# Altium schematic sheet Amplifier_ADC.SchDoc
size 420 x 297 mm; DocumentNumber: Введите номер платы + Э3; SheetNumber: 5; Format: A3
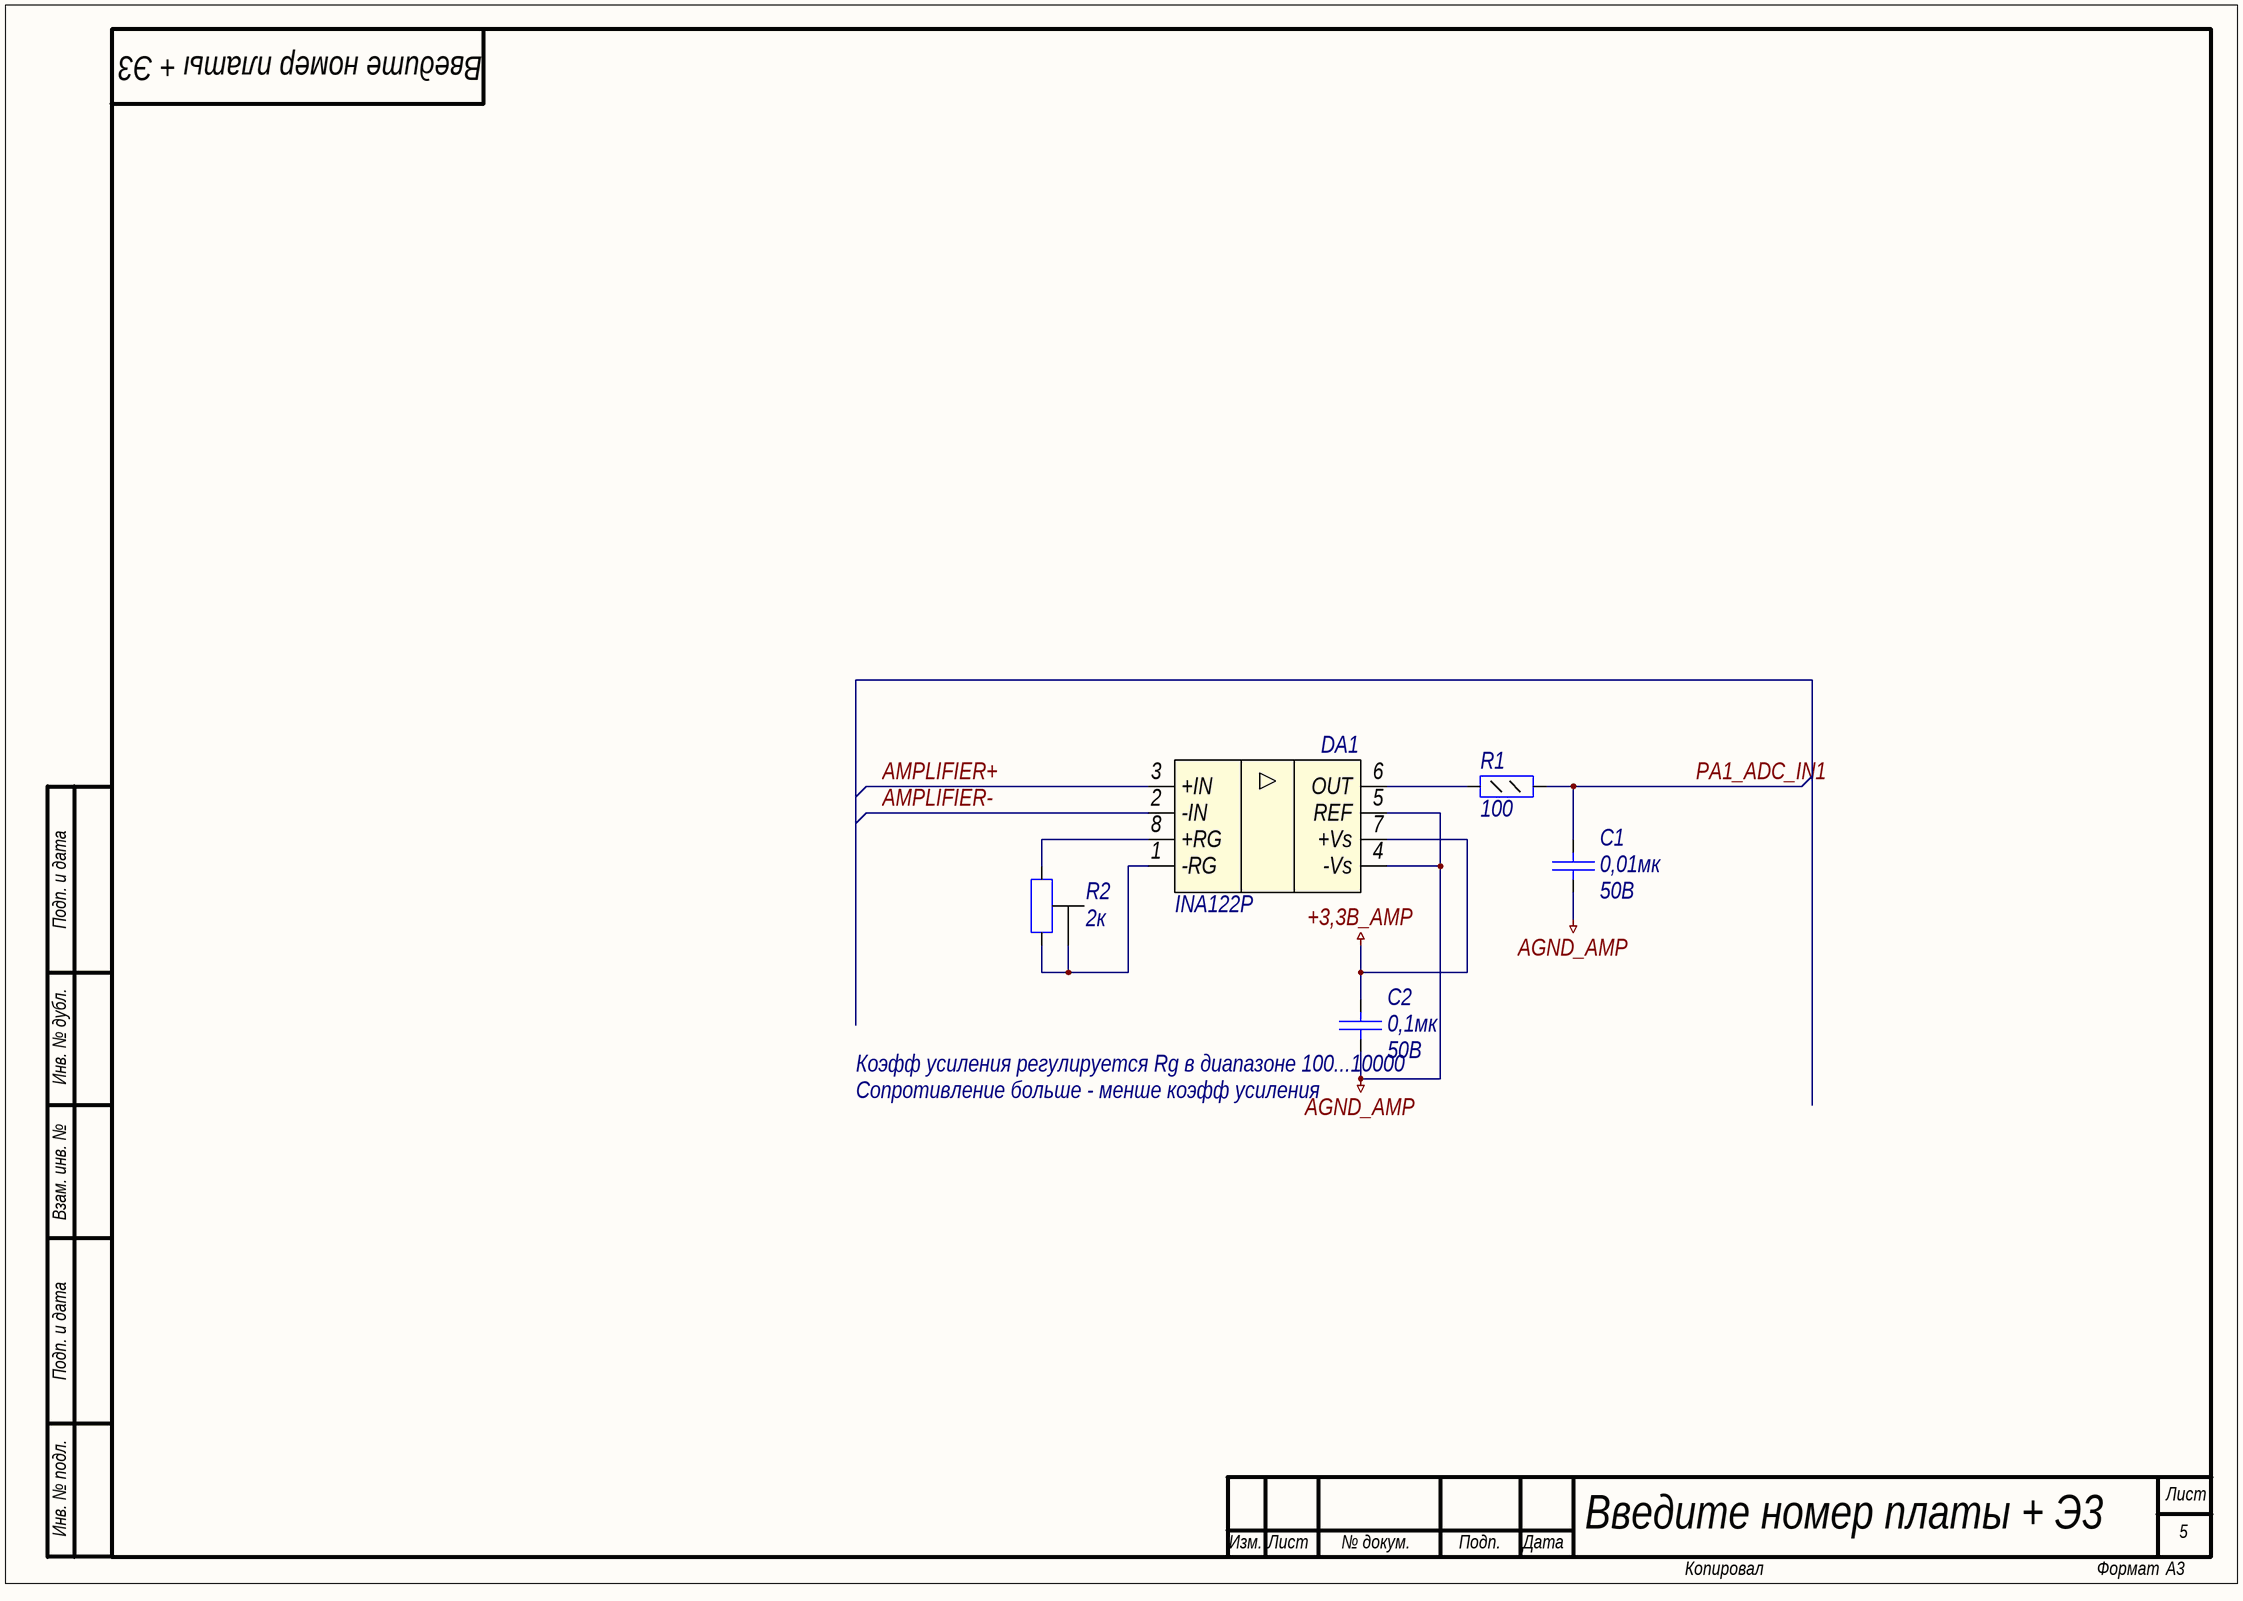
[diagram p0: Amplifier_ADC.SchDoc]

## Parts
C1  value 0,01мк  Voltage: 50B  [C0805]  (hidden comment: Capacitor)
C2  value 0,1мк  Voltage: 50В  [C0805]  (hidden comment: Capacitor)
DA1  Part Number: INA122P  [DIP8]  (hidden comment: INA122)
R1  value 100  [R0805]  (hidden comment: Resistor_0,125Вт)
R2  value 2к  [3296Y]  (hidden comment: Potentiometer)

## Nets
+3,3В_AMP: C2.2 DA1.7(+Vs)
AGND_AMP: C1.1 C2.1 DA1.4(-Vs) DA1.5(REF)
AMPLIFIER+: DA1.3(+IN)
AMPLIFIER-: DA1.2(-IN)
PA1_ADC_IN1: C1.2 R1.2
NetDA1_1: DA1.1(-RG) R2.2 R2.3
NetDA1_6: DA1.6(OUT) R1.1
NetDA1_8: DA1.8(+RG) R2.1

## Notes on the sheet
- Подп. и дата
- Инв. № дубл.
- (near C2) Коэфф усиления регулируется Rg в диапазоне 100...10000
- (near C2) Сопротивление больше - менше коэфф усиления
- Взам. инв. №
- Инв. № подл.
- Лист
- Изм.
- № докум.
- Подп.
- Дата
- Копировал
- Формат

## Library data of the parts
C1 = cap136: Конденсатор; Part Name: Ceramic; Manufacture: Murata; Part Number: GRM216R71H103K; id: cap136; TKE: X7R
C2 = cap160: Конденсатор; Part Name: Ceramic; Manufacture: Murata; Part Number: GRM21BR71H104KA01L; id: cap160; TKE: X7R
DA1 = amp12: Low Cost Low Power  Instrumentation Amplifier; Manufacture: Texas Instruments; id: amp12; Rail-to-rail: yes; Supply Voltage: 2,2В–36В or -0,9/+1,3В to (+-)18B; Supply Current max: 85uA; Bandwidth: g=5 120kHz, g=100 5kHz, g=500 0,9kHz; Input Bias Current: 25nA; CMRR: 96dB; Offset voltage: 0,25mB; Channels: 1; Part Name: Instrumentation Amplifier
R1 = res49: Резистор; Manufacture: Yageo; Part Number: RC0805FR-07100RL; id: res49; Accuracy: 0.01; Part Name: Resistor; Power: 0,125Вт
R2 = res986: Part Name: Resistor; Manufacture: Bourns; Part Number: 3296Y-1-202LF; id: res986; Accuracy: 0.1; Power: 0,5Вт